# EasyEDA Pro project ProPrj_STM32F103ZET6_2025-04-15.epro, schematic STM32F103ZET6 开发板

## Sheets
1 核心: Board Name: STM32F103ZET6 开发板; Create Date: 2025-03-17; Page Name: 核心; Project Name: STM32F103ZET6; Schematic Name: STM32F103ZET6 开发板; Update Date: 2025-03-17; Add into BOM: yes; Company: NEU; Convert to PCB: yes; Date: 2024-02-03; Draw By: HaoShuai; REV: 1.0; Sheet: 1/3
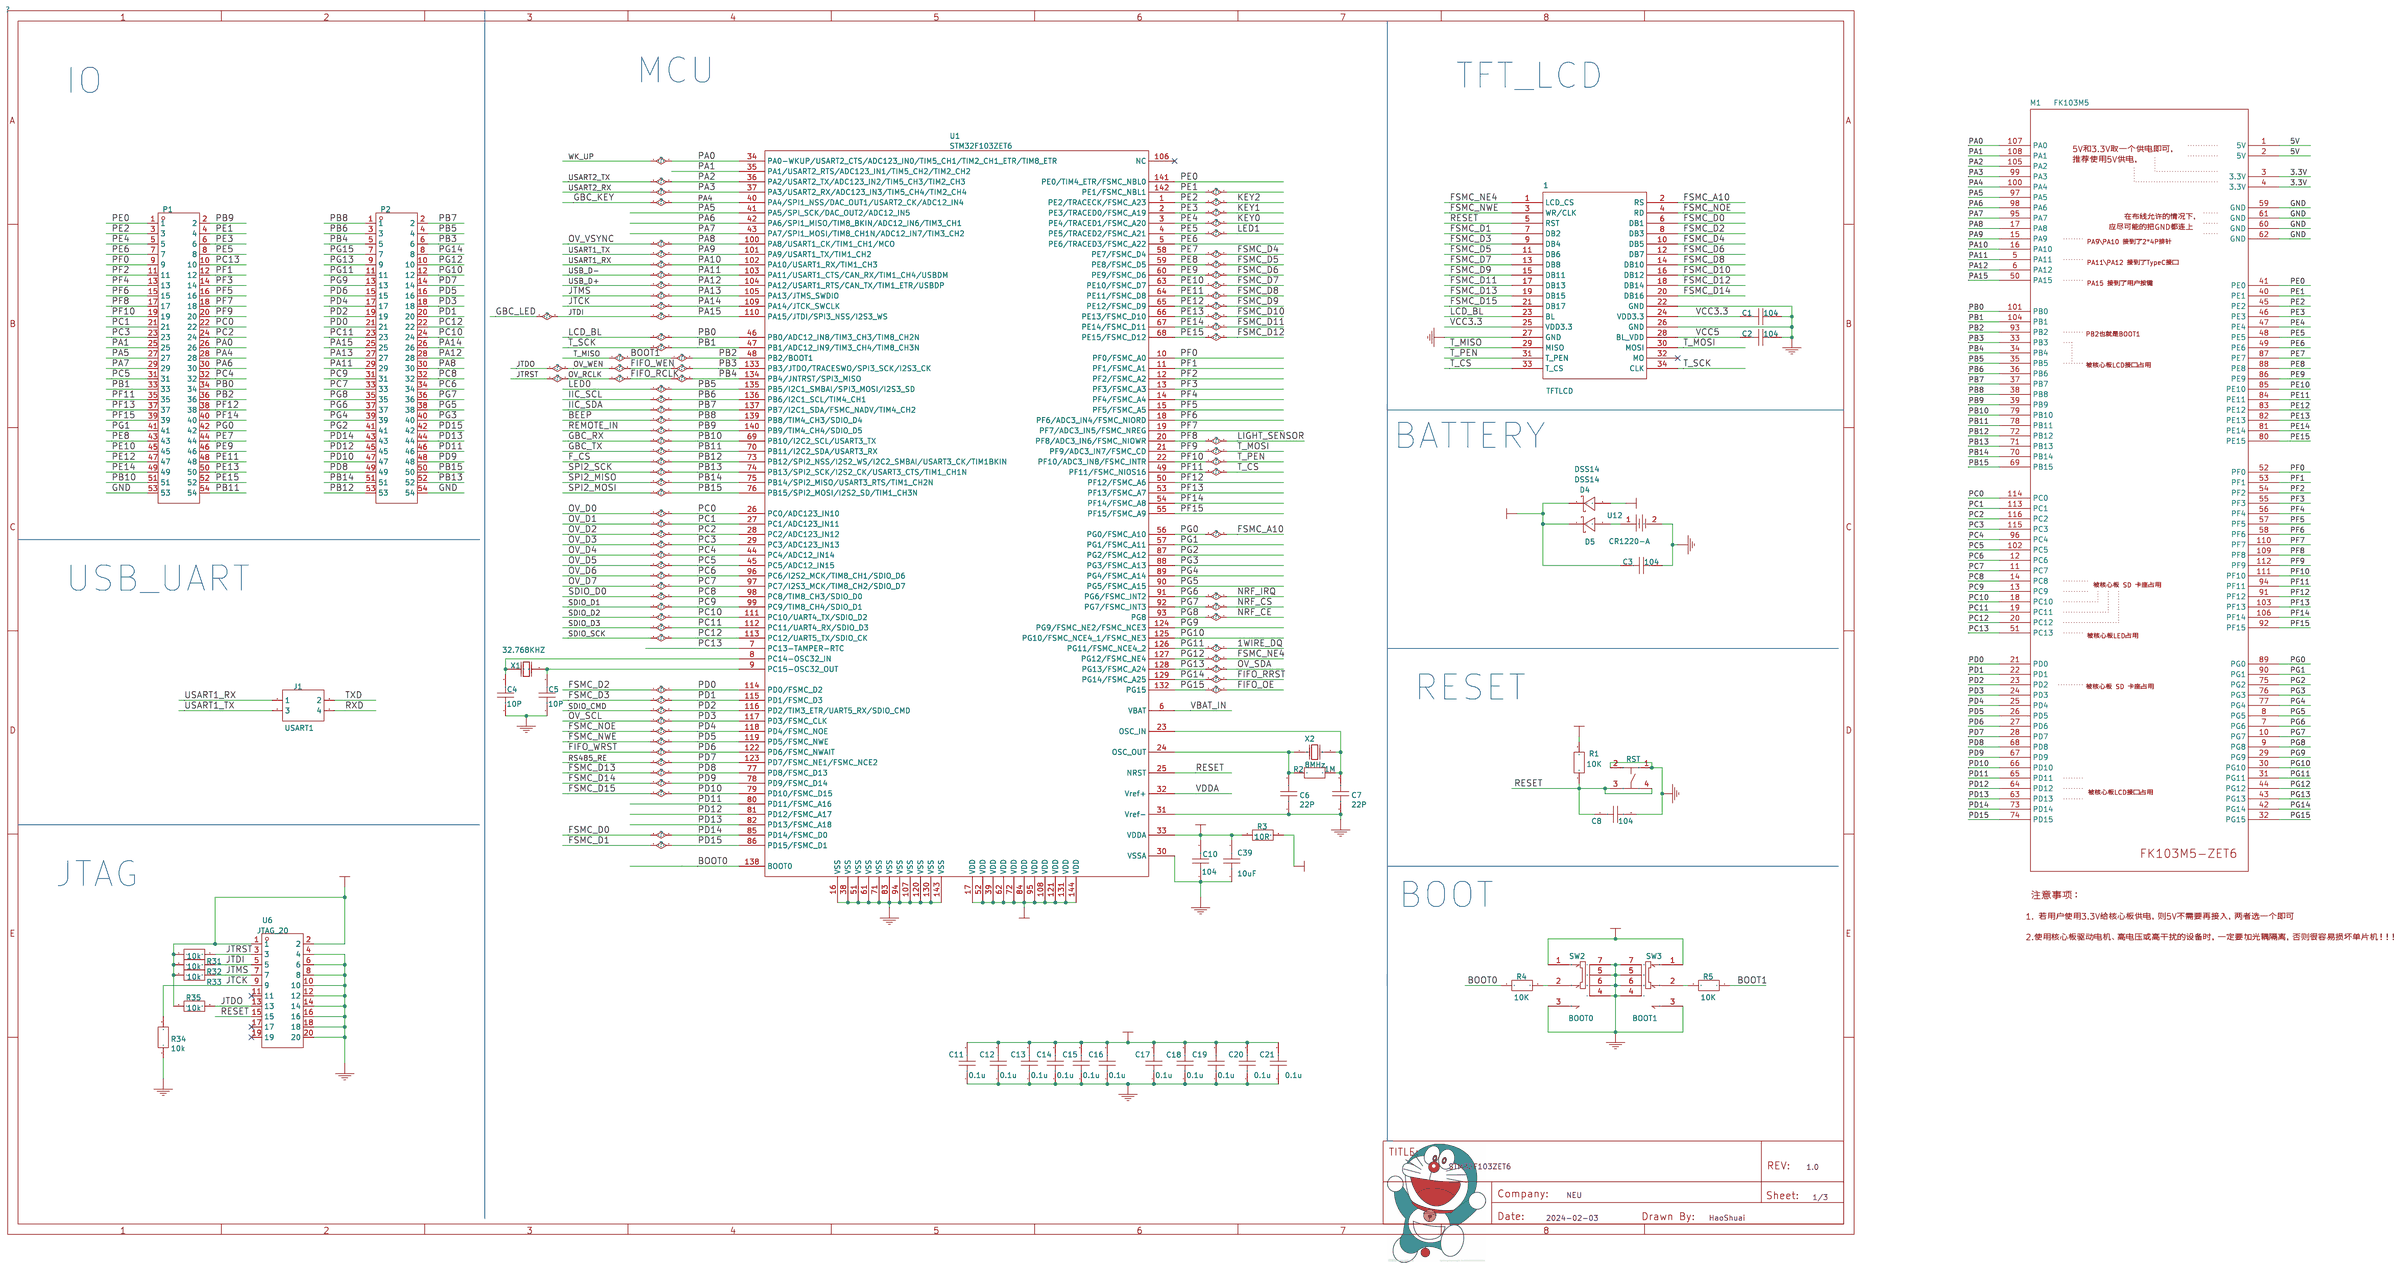
[diagram p1: 核心]
2 电源&USB
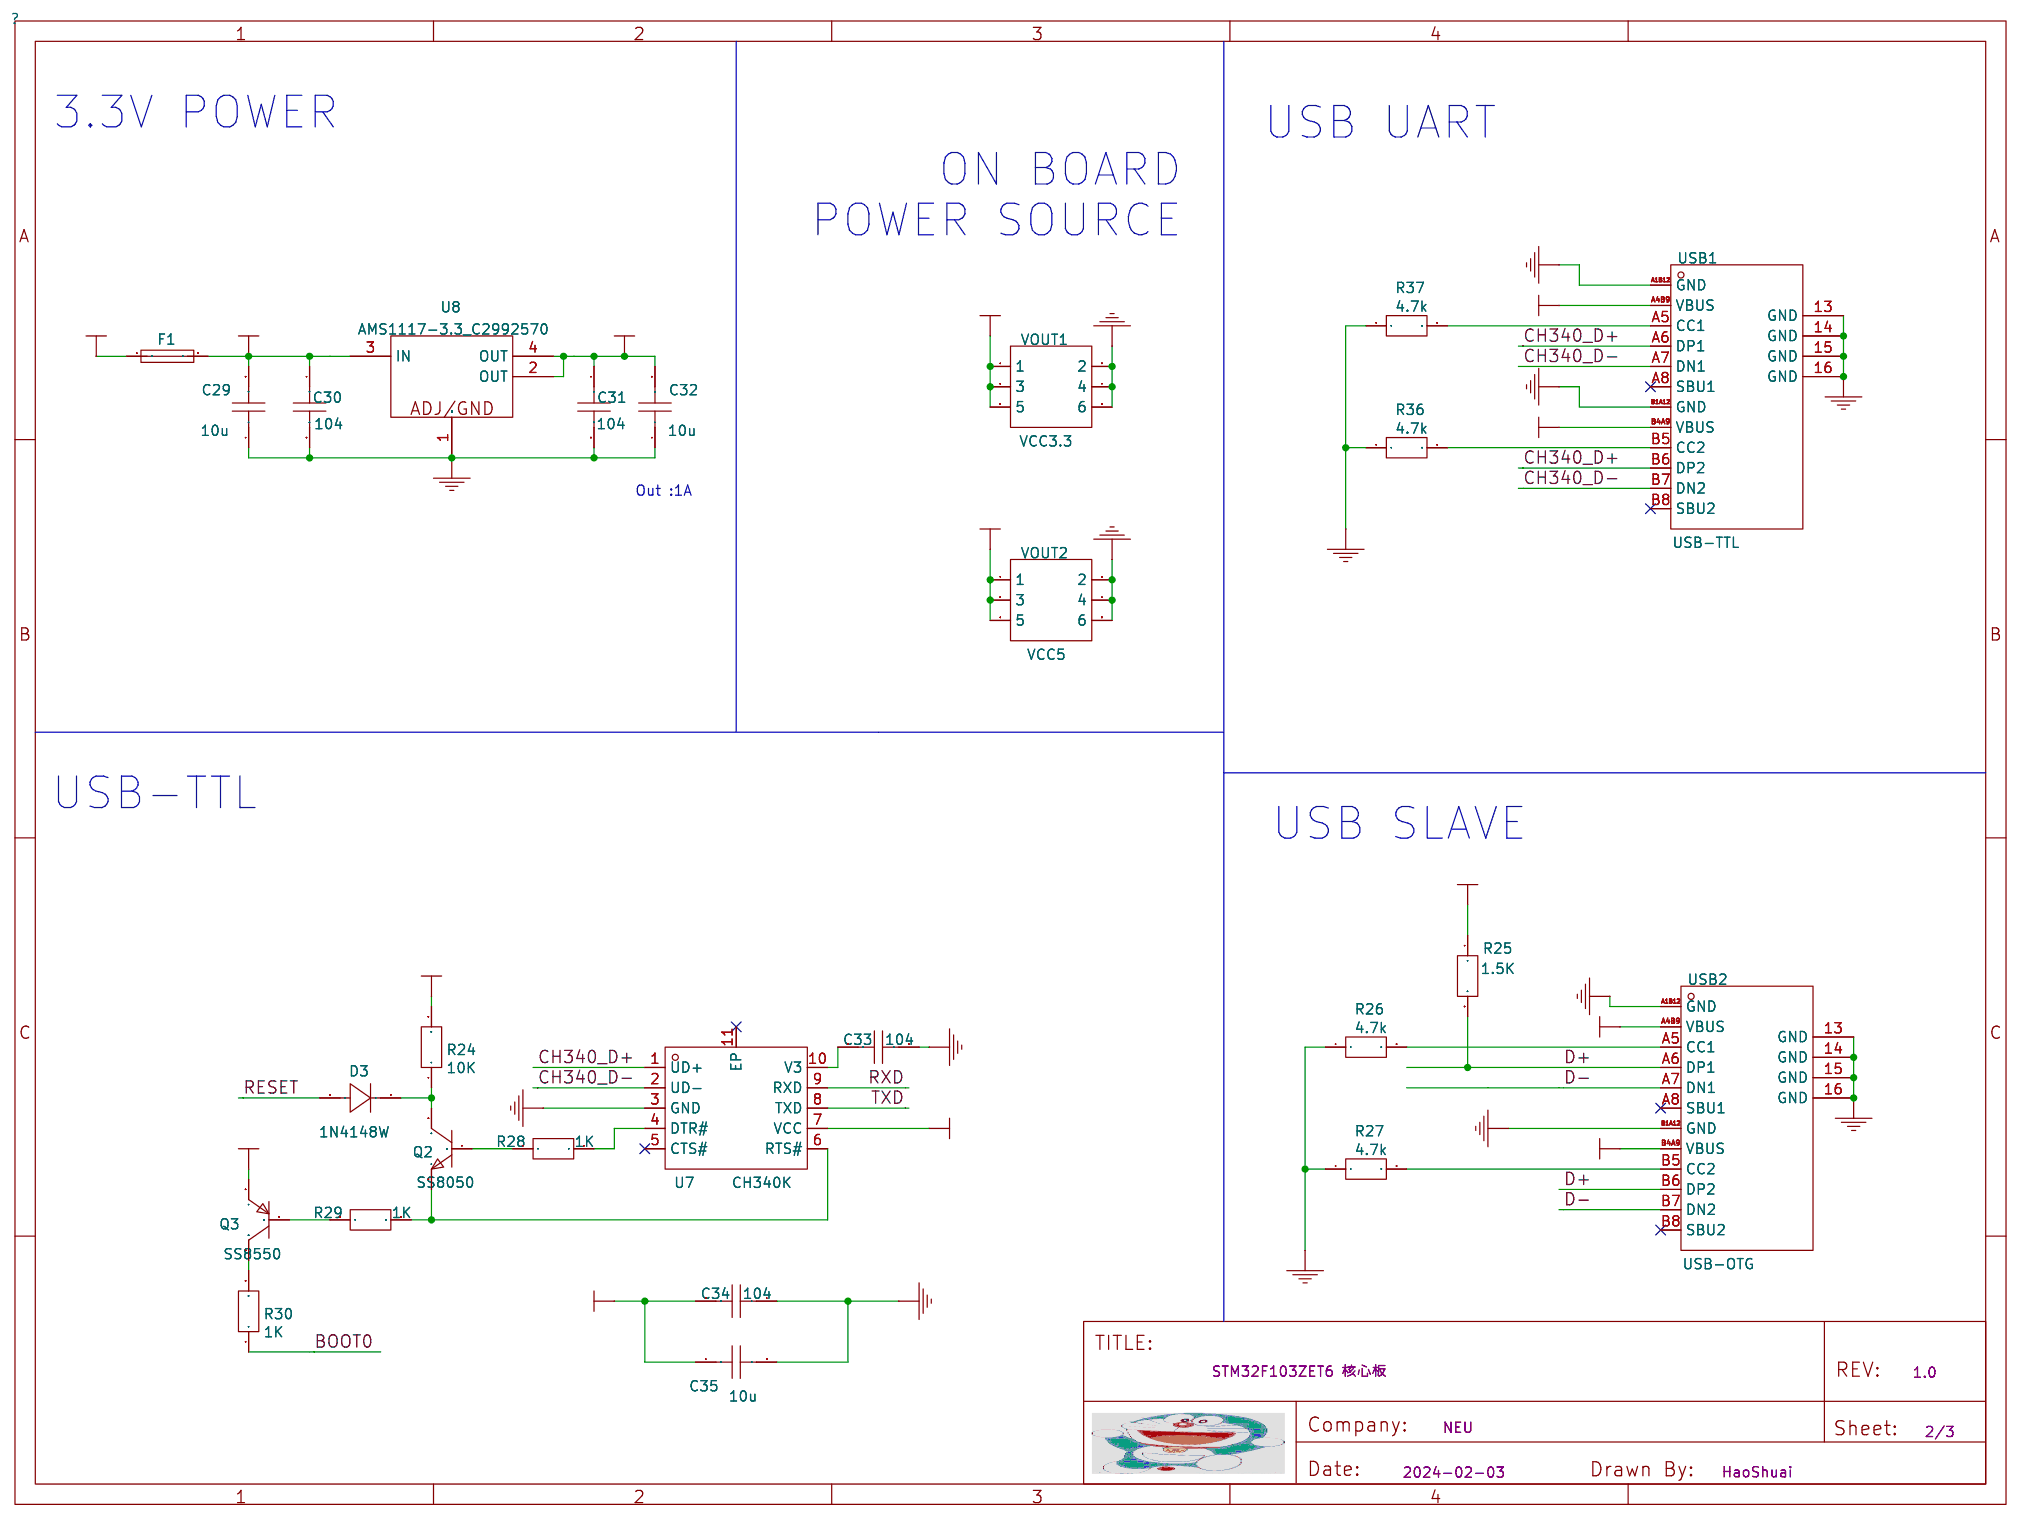
[diagram p2: 电源&USB]
3 外设
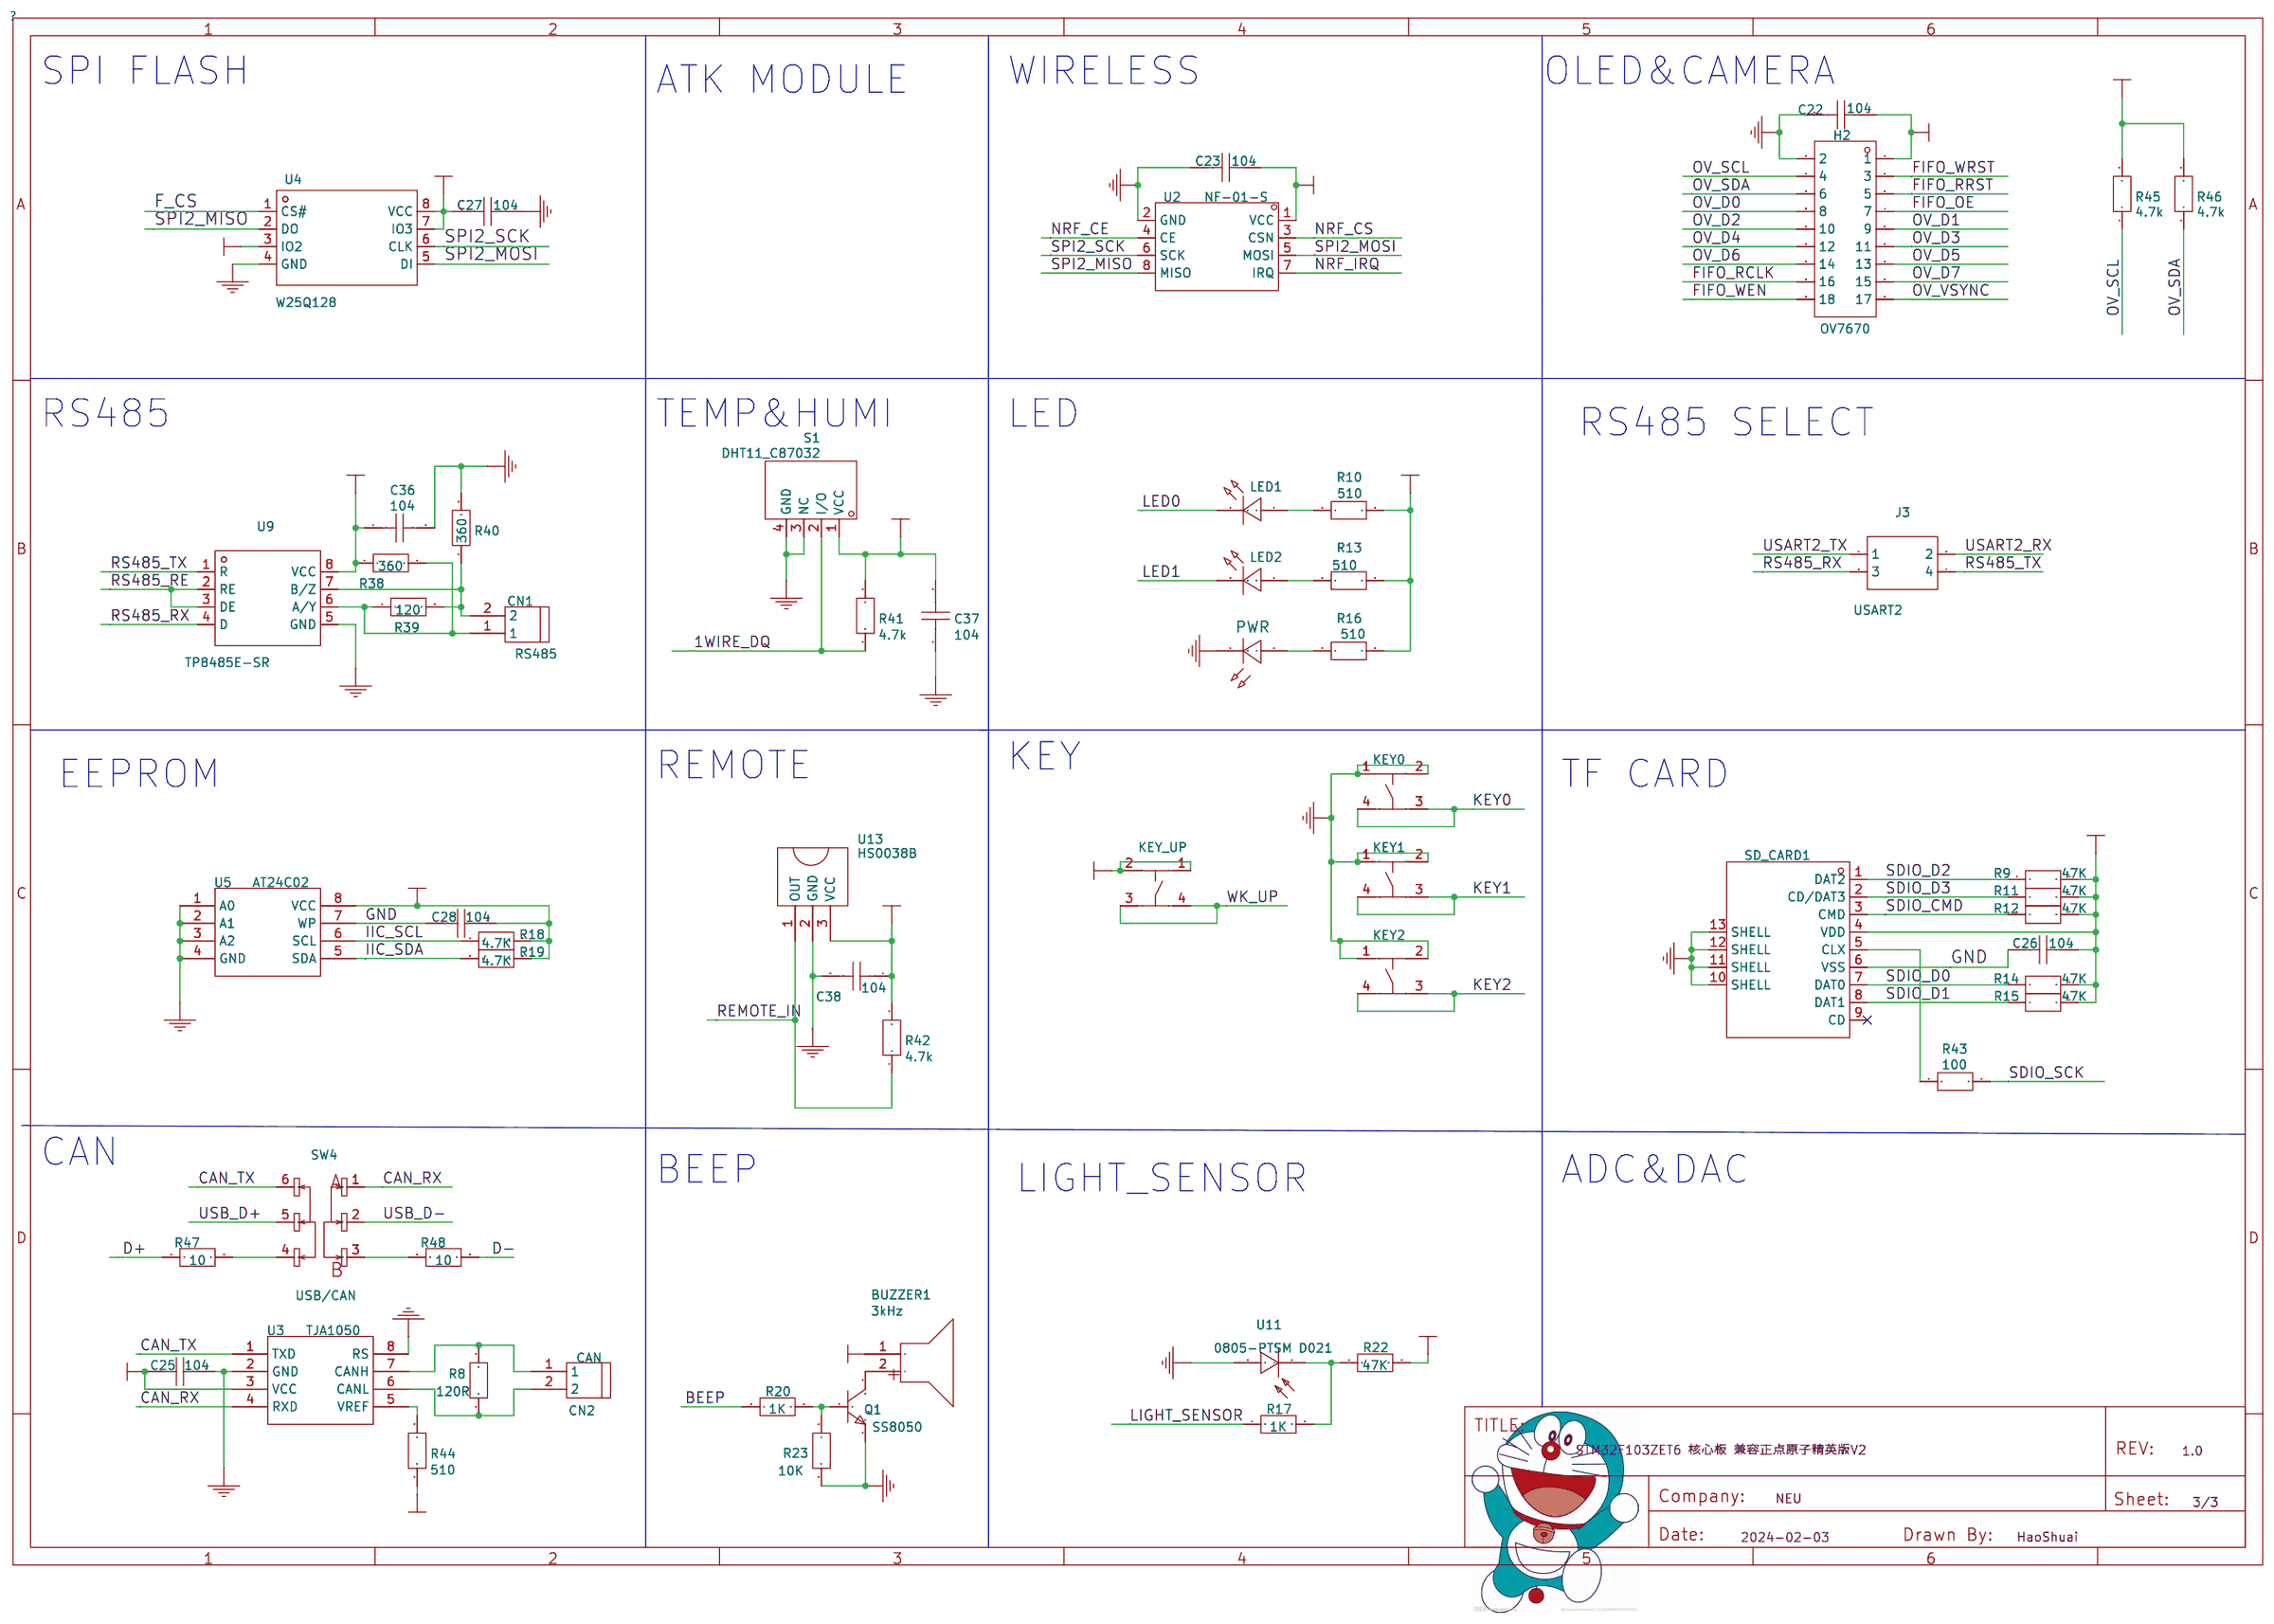
[diagram p3: 外设]

## Parts
sheet 外设
BUZZER1  3kHz  [BUZ-TH_BD9.0-P5.00-D0.6-FD]
C22  104  [C0603]
C23  104  [C0603]
C25  104  [C0603]
C26  104  [C0603]
C27  104  [C0603]
C28  104  [C0603]
C36  104  [C0603]
C37  104  [C0603]
C38  104  [C0603]
CN1  RS485  [CONN-TH_2P-P2.50_XH-2AW]
CN2  CAN  [CONN-TH_2P-P2.50_XH-2AW]
H2  OV7670  [HDR-TH_18P-P2.54-V-F-R2-C9-S2.54-1]
J3  USART2  [HDR-M-2.54_2X2]
LED1  LED-0603_G  [LED0603_GREEN]
LED2  LED-0603_B  [LED0603_BLUE]
PWR  -  [LED_0603]
Q1  SS8050  [SOT-23-3_L2.9-W1.3-P1.90-LS2.4-BR]
R8  120R  [R0603]
R9  47K  [R0603]
R10  510  [R0603]
R11  47K  [R0603]
R12  47K  [R0603]
R13  510  [R0603]
R14  47K  [R0603]
R15  47K  [R0603]
R16  510  [R0603]
R17  1K  [R0603]
R18  4.7K  [R0603]
R19  4.7K  [R0603]
R20  1K  [R0603]
R22  47K  [R0603]
R23  10K  [R0603]
R38  360  [R0603]
R39  120  [R0603]
R40  360  [R0603]
R41  4.7k  [R0603]
R42  4.7k  [R0603]
R43  100  [R0603]
R44  510  [R0603]
R45  4.7k  [R0603]
R46  4.7k  [R0603]
R47  10  [R0603]
R48  10  [R0603]
S1  DHT11_C87032  [SENSOR-TH_DHT11-1]
SD_CARD1  THD2528-11SD-GF  [TF-SMD_THD2528-11SD-GF]
SW4  USB/CAN  [SW-TH_6P-L9.1-W3.5-P2.50]
SW5  KEY_UP  [SW-SMD_4P-L4.2-W3.2-P2.15-LS4.6]
SW6  KEY0  [SW-SMD_4P-L4.2-W3.2-P2.15-LS4.6]
SW7  KEY1  [SW-SMD_4P-L4.2-W3.2-P2.15-LS4.6]
SW8  KEY2  [SW-SMD_4P-L4.2-W3.2-P2.15-LS4.6]
U2  NF-01-S  [NF-01-S]
U3  TJA1050  [SOIC-8_L5.0-W4.0-P1.27-LS6.0-BL]
U4  W25Q128  [SOIC-8_L5.3-W5.3-P1.27-LS8.0-BL]
U5  AT24C02  [SOIC-8_L5.0-W4.0-P1.27-LS6.0-BL]
U9  TP8485E-SR  [SOIC-8_L5.0-W4.0-P1.27-LS6.0-BL]
U11  0805-PTSM D021  [OPTO-SMD_L2.0-W1.3-RD]
U13  HS0038B  [OPTO-TH_HS0038B-A]
sheet 核心
1  TFTLCD  [TFTLCD_2_4/2_8/3_5]
C1  104  [C0603]
C2  104  [C0603]
C3  104  [C0603]
C4  10P  [C0603]
C5  10P  [C0603]
C6  22P  [C0603]
C7  22P  [C0603]
C8  104  [C0603]
C10  104  [C0603]
C11  0.1u  [C0603]
C12  0.1u  [C0603]
C13  0.1u  [C0603]
C14  0.1u  [C0603]
C15  0.1u  [C0603]
C16  0.1u  [C0603]
C17  0.1u  [C0603]
C18  0.1u  [C0603]
C19  0.1u  [C0603]
C20  0.1u  [C0603]
C21  0.1u  [C0603]
C39  10uF  [C0805]
D4  DSS14  [SOD-123_L2.8-W1.8-LS3.7-RD]
D5  DSS14  [SOD-123_L2.8-W1.8-LS3.7-RD]
J1  USART1  [HDR-M-2.54_2X2]
M1  FK103M5  [zet60.11]
P1  X6521WV-2×27H-C30D60  [HDR-TH_54P-2.54-V-M-R2-C27-S2.54]
P2  X6521WV-2×27H-C30D60  [HDR-TH_54P-2.54-V-M-R2-C27-S2.54]
R1  10K  [R0603]
R2  1M  [R0603]
R3  10R  [R0603]
R4  10K  [R0603]
R5  10K  [R0603]
R31  10k  [R0603]
R32  10k  [R0603]
R33  10k  [R0603]
R34  10k  [R0603]
R35  10k  [R0603]
SW1  RST  [SW-SMD_4P-L4.2-W3.2-P2.15-LS4.6]
SW2  BOOT0  [CONN-TH_TA-3524A-A2]
SW3  BOOT1  [CONN-TH_TA-3524A-A2]
U1  STM32F103ZET6  [LQFP144]
U6  JTAG_20  [IDC-TH_20P-P2.54_SAMTEC-HTST-110-01-X-D]
U12  CR1220-A  [BAT-SMD_CR1220-2]
X1  32.768KHZ  [OSC-TH_BD2.0-P0.70-D0.3]
X2  8MHz  [CRYSTAL-SMD_L5.0-W3.2]
sheet 电源&USB
C29  10u  [C0805]
C30  104  [C0603]
C31  104  [C0603]
C32  10u  [C0805]
C33  104  [C0603]
C34  104  [C0603]
C35  10u  [C0805]
D3  1N4148W  [SOD-123_L2.8-W1.8-LS3.7-RD]
F1  6V1A  [F0603]
Q2  SS8050  [SOT-23-3_L2.9-W1.3-P1.90-LS2.4-BR]
Q3  SS8550  [SOT-23-3_L2.9-W1.3-P1.90-LS2.4-BR]
R24  10K  [R0603]
R25  1.5K  [R0603]
R26  4.7k  [R0603]
R27  4.7k  [R0603]
R28  1K  [R0603]
R29  1K  [R0603]
R30  1K  [R0603]
R36  4.7k  [R0603]
R37  4.7k  [R0603]
U7  CH340K  [CH340K中央焊盘修改]
U8  AMS1117-3.3_C2992570  [SOT-223-3_L6.4-W3.5-P2.30-LS7.0-BR]
USB1  USB-TTL  [USB-C-SMD_TYPEC-304S-ACP16]
USB2  USB-OTG  [USB-C-SMD_TYPEC-304S-ACP16]
VOUT1  VCC3.3  [HDR-M-2.54_2X3]
VOUT2  VCC5  [HDR-M-2.54_2X3]

## Library data of the parts
BUZZER1 = 3kHz: Supplier: LCSC; Supplier Part: C96102; Manufacturer: 华能; Manufacturer Part: HNB09A03; JLCPCB Part Class: Extended Part
C1-C3 C8 C10 C22 C23 C25-C28 C30 C31 C33 C34 C36-C38 = 104
CN1 = RS485: Supplier: LCSC; Manufacturer: BOOMELE; Manufacturer Part: XH-2AW; Supplier Part: C33132; JLCPCB Part Class: Extended Part
CN2 = CAN: Supplier: LCSC; Manufacturer: BOOMELE; Manufacturer Part: XH-2AW; Supplier Part: C33132; JLCPCB Part Class: Extended Part
H2 = OV7670: Supplier: LCSC; Manufacturer: BOOMELE; Manufacturer Part: Header-Female-2.54_2x9; Supplier Part: C71956; JLCPCB Part Class: Extended Part
J3 = USART2: Supplier Part: C66690; Supplier: LCSC
LED1 = LED-0603_G: Manufacturer: EVERLIGHT(台湾亿光); Manufacturer Part: 19-217/GHC-YR1S2/3T; Supplier Part: C72043; Supplier: LCSC
LED2 = LED-0603_B: Manufacturer: EVERLIGHT(台湾亿光); Manufacturer Part: 19-217/BHC-ZL1M2RY/3T; Supplier Part: C72041; Supplier: LCSC
PWR = LED_0603-R: Supplier Footprint: 0603
Q1 Q2 = SS8050: Supplier: LCSC; Supplier Part: C2688219; Manufacturer: WPMtek(维攀微); JLCPCB Part Class: Extended Part
R8 = 120R
R9 R11 R12 R14 R15 R22 = 47K
R10 R13 R16 R44 = 510
R17 R20 R28-R30 = 1K
R18 R19 = 4.7K
R1 R4 R5 R23 R24 = 10K
R38 R40 = 360
R39 = 120
R26 R27 R36 R37 R41 R42 R45 R46 = 4.7k
R43 = 100
R47 R48 = 10
S1 = DHT11_C87032: Supplier Part: C87032; Supplier: LCSC; Manufacturer: null; Manufacturer Part: DHT11; JLCPCB Part Class: Extended Part
SD_CARD1 = THD2528-11SD-GF: Supplier: LCSC; Supplier Part: C283232; Manufacturer: THD; JLCPCB Part Class: Extended Part
SW4 = USB/CAN: Supplier: LCSC; Supplier Part: C514021; Manufacturer: Yuandi; Manufacturer Part: TA-3530-A1; JLCPCB Part Class: Extended Part
SW5 = KEY_UP: Supplier: LCSC; Supplier Part: C778166; Manufacturer: G-Switch; Manufacturer Part: GT-TC048A-H025-L1; JLCPCB Part Class: Extended Part
SW6 = KEY0: Supplier: LCSC; Supplier Part: C778166; Manufacturer: G-Switch; Manufacturer Part: GT-TC048A-H025-L1; JLCPCB Part Class: Extended Part
SW7 = KEY1: Supplier: LCSC; Supplier Part: C778166; Manufacturer: G-Switch; Manufacturer Part: GT-TC048A-H025-L1; JLCPCB Part Class: Extended Part
SW8 = KEY2: Supplier: LCSC; Supplier Part: C778166; Manufacturer: G-Switch; Manufacturer Part: GT-TC048A-H025-L1; JLCPCB Part Class: Extended Part
U2 = NF-01-S: Supplier: LCSC; Supplier Part: C135576; Manufacturer: Ai-Thinker; JLCPCB Part Class: Extended Part
U3 = TJA1050: Supplier: LCSC; Manufacturer: NXP; Manufacturer Part: TJA1050T/CM,118; Supplier Part: C6952; JLCPCB Part Class: Basic Part
U4 = W25Q128: Supplier: LCSC; Manufacturer: WINBOND; Manufacturer Part: W25Q128JVSIQTR; Supplier Part: C2763561; JLCPCB Part Class: Basic Part
U5 = AT24C02: Supplier: LCSC; Manufacturer: MICROCHIP; Manufacturer Part: AT24C02D-SSHM-T; Supplier Part: C34807; JLCPCB Part Class: Extended Part
U9 = TP8485E-SR: Supplier: LCSC; Manufacturer: 3PEAK; Supplier Part: C94206; JLCPCB Part Class: Extended Part
U11 = 0805-PTSM D021: Supplier: LCSC; Supplier Part: C242254; Manufacturer: JCHL(晶创和立); Manufacturer Part: 0805-PTSMD021; JLCPCB Part Class: Extended Part
U13 = HS0038B: Supplier Part: C9900001501; Supplier Footprint: DIP-3; JLCPCB Part Class: 扩展库; Supplier: LCSC
1 = TFTLCD: Supplier Part: C92264; Supplier: LCSC
C4 C5 = 10P
C6 C7 = 22P
C11-C21 = 0.1u
C39 = CAP_0805: Supplier Footprint: 0805
D4 D5 = DSS14_C59293: 正向压降(Vf):550mV@1A;直流反向耐压(Vr):40V;平均整流电流(Io):1A;; LCSC Part Name: 电压:40V 电流:1A; Supplier Part: C59293; Manufacturer: 星海; Supplier Footprint: SOD-123FL; JLCPCB Part Class: 扩展库; Datasheet: https://atta.szlcsc.com/upload/public/pdf/source/20151026/1457707506941.pdf; Supplier: LCSC; Forward Voltage (Vf@If): 550mV@1A; Reverse Voltage (Vr): 40V; Average Rectified Current (Io): 1A
J1 = USART1: Supplier Part: C66690; Supplier: LCSC
M1 = FK103M5
P1 P2 = X6521WV-2×27H-C30D60: Supplier: LCSC; Supplier Part: C725899; Manufacturer: XKB Connectivity; JLCPCB Part Class: Extended Part
R2 = 1M
R3 = 10R
R31-R35 = 10k
SW1 = RST: Supplier: LCSC; Supplier Part: C778166; Manufacturer: G-Switch; Manufacturer Part: GT-TC048A-H025-L1; JLCPCB Part Class: Extended Part
SW2 = BOOT0: Supplier: LCSC; Supplier Part: C730329; Manufacturer: Yuandi; Manufacturer Part: TA-3524A-A1-W; JLCPCB Part Class: Extended Part
SW3 = BOOT1: Supplier: LCSC; Supplier Part: C730329; Manufacturer: Yuandi; Manufacturer Part: TA-3524A-A1-W; JLCPCB Part Class: Extended Part
U1 = STM32F103ZET6
U6 = JTAG_20_C9900040131: Supplier: LCSC; Supplier Part: C9900040131; Manufacturer: null; JLCPCB Part Class: Extended Part
U12 = CR1220-A: Supplier: LCSC; Supplier Part: C9900016718; Manufacturer: null; JLCPCB Part Class: Extended Part
X1 = 32.768KHZ: Supplier: LCSC; Supplier Part: C389950; Manufacturer: CITIZEN; Manufacturer Part: CFS20632768DZF
X2 = X50328MSB2GI: 晶振类型:贴片晶振;频率:8MHz;常温频差:±10ppm;外接负载电容:20pF;频率稳定度(全温):±50ppm;; LCSC Part Name: 8MHz ±10ppm 20pF YSX530GA; Supplier Part: C115962; Manufacturer: YXC(扬兴晶振); Supplier Footprint: SMD5032; JLCPCB Part Class: 基础库; Datasheet: https://atta.szlcsc.com/upload/public/pdf/source/20230220/0EBFFB9D6D8CE6A211407822BBB6C516.pdf; Supplier: LCSC; Crystal Type: 贴片晶振; Normal temperature Frequency Tolerance: ±10ppm; External load capacitor: 20pF; Frequency Stability(Full temperature range): ±50ppm; Operating Temperature: -40℃~+85℃
C29 C32 = 100u
C35 = 10u
D3 = 1N4148W: Supplier: LCSC; Supplier Part: C1884539; Manufacturer: YFW佑风微; JLCPCB Part Class: Extended Part
F1 = 6V1A: Supplier: LCSC; Supplier Part: C2757929; Manufacturer: BHFUSE(佰宏); Manufacturer Part: BSMD0603L-100; JLCPCB Part Class: Extended Part
Q3 = SS8550: Supplier: LCSC; Supplier Part: C2762207; Manufacturer: 晶导微电子; JLCPCB Part Class: Extended Part
R25 = 1.5K
U7 = CH340K: Supplier: LCSC; Supplier Part: C968586; Manufacturer: WCH(Jiangsu Qin Heng); JLCPCB Part Class: Extended Part
U8 = AMS1117-3.3_C2992570: Supplier: LCSC; Supplier Part: C2992570; Manufacturer: 国芯佳品; Manufacturer Part: AMS1117-3.3; JLCPCB Part Class: Extended Part
USB1 = USB-TTL: Supplier: LCSC; Supplier Part: C720630; Manufacturer: XUNPU; Manufacturer Part: TYPEC-304S-ACP16; JLCPCB Part Class: Extended Part
USB2 = USB-OTG: Supplier: LCSC; Supplier Part: C720630; Manufacturer: XUNPU; Manufacturer Part: TYPEC-304S-ACP16; JLCPCB Part Class: Extended Part
VOUT1 = VCC3.3: Supplier Part: C65114; Supplier: LCSC
VOUT2 = VCC5: Supplier Part: C65114; Supplier: LCSC

## Nets
3.3V: M1.3(3.3V) M1.4(3.3V)
5V: M1.1(5V) M1.2(5V)
GND: 1.22(GND) 1.26(GND) 1.27(GND) C1.2 C2.2 C3.2 C4.1 C5.1 C6.1 C7.1 C8.2 C10.1 C11.1 C12.1 C13.1 C14.1 C15.1 C16.1 C17.1 C18.1 C19.1 C20.1 C21.1 C22.2 C23.2 C25.2 C26.2 C27.1 C28.1 C29.1 C30.2 C31.2 C32.1 C33.1 C34.1 C35.2 C36.2 C37.1 C38.2 C39.2 H2.2 M1.59(GND) M1.60(GND) M1.61(GND) M1.62(GND) P1.53 P2.54 PWR.1(C) Q1.2(E) R23.2 R26.1 R27.1 R34.1 R36.1 R37.1 R40.2 S1.3(NC) S1.4(GND) SD_CARD1.6(VSS) SD_CARD1.10(SHELL) SD_CARD1.11(SHELL) SD_CARD1.12(SHELL) SD_CARD1.13(SHELL) SW1.1 SW1.2 SW2.3 SW2.4 SW2.5 SW2.6 SW2.7 SW3.3 SW3.4 SW3.5 SW3.6 SW3.7 SW6.1 SW6.2 SW7.1 SW7.2 SW8.1 SW8.2 U1.16(VSS) U1.30(VSSA) U1.31(Vref-) U1.38(VSS) U1.51(VSS) U1.61(VSS) U1.71(VSS) U1.83(VSS) U1.94(VSS) U1.107(VSS) U1.120(VSS) U1.130(VSS) U1.143(VSS) U2.2(GND) U3.2(GND) U3.8(RS) U4.4(GND) U5.1(A0) U5.2(A1) U5.3(A2) U5.4(GND) U5.7(WP) U6.4 U6.6 U6.8 U6.10 U6.12 U6.14 U6.16 U6.18 U6.20 U7.3(GND) U8.1(ADJ/GND) U9.5(GND) U11.2(A) U12.2 U13.2(GND) USB1.13(GND) USB1.14(GND) USB1.15(GND) USB1.16(GND) USB1.A1B12(GND) USB1.B1A12(GND) USB2.13(GND) USB2.14(GND) USB2.15(GND) USB2.16(GND) USB2.A1B12(GND) USB2.B1A12(GND) VOUT1.2 VOUT1.4 VOUT1.6 VOUT2.2 VOUT2.4 VOUT2.6
VBAT_IN: C3.1 D4.1(K) D5.1(K) U1.6(VBAT)
VCC3.3: 1.24(VDD3.3) 1.25(VDD3.3) BUZZER1.1(+) C1.1 C11.2 C12.2 C13.2 C14.2 C15.2 C16.2 C17.2 C18.2 C19.2 C20.2 C21.2 C22.1 C23.1 C26.1 C27.2 C28.2 C31.1 C32.2 C36.1 C37.2 C38.1 D4.2(A) H2.1 Q3.2(E) R1.2 R3.2 R9.2 R10.2 R11.2 R12.2 R13.1 R14.2 R15.2 R16.1 R18.2 R19.2 R22.2 R24.2 R25.1 R31.1 R32.1 R33.1 R35.1 R38.1 R41.2 R42.2 R44.1 R45.2 R46.2 S1.1(VCC) SD_CARD1.4(VDD) SW2.1 SW3.1 SW5.1 SW5.2 U1.17(VDD) U1.39(VDD) U1.52(VDD) U1.62(VDD) U1.72(VDD) U1.84(VDD) U1.95(VDD) U1.108(VDD) U1.121(VDD) U1.131(VDD) U1.144(VDD) U2.1(VCC) U4.3(IO2) U4.7(IO3) U4.8(VCC) U5.8(VCC) U6.1 U6.2 U8.2(OUT) U8.4(OUT) U9.8(VCC) U13.3(VCC) VOUT1.1 VOUT1.3 VOUT1.5
VCC5: 1.28(BL_VDD) C2.1 C25.1 C29.2 C30.1 C34.2 C35.1 F1.2 U3.3(VCC) U7.7(VCC) U8.3(IN) VOUT2.1 VOUT2.3 VOUT2.5
VDDA: C10.2 C39.1 R3.1 U1.32(Vref+) U1.33(VDDA)
1WIRE_DQ: M1.31(PG11) P2.11 R41.1 S1.2(I/O) U1.126(PG11/FSMC_NCE4_2)
BEEP: M1.38(PB8) P2.1 R20.1 U1.139(PB8/TIM4_CH3/SDIO_D4)
BOOT0: R4.1 R30.1 U1.138(BOOT0)
BOOT1: 1.29(MISO) M1.93(PB2) P1.36 R5.1 U1.48(PB2/BOOT1)
CAN_RX: SW4.1 U3.4(RXD)
CAN_TX: SW4.6 U3.1(TXD)
CH340_D+: U7.1(UD+) USB1.A6(DP1) USB1.B6(DP2)
CH340_D-: U7.2(UD-) USB1.A7(DN1) USB1.B7(DN2)
D+: R25.2 R47.1 USB2.A6(DP1) USB2.B6(DP2)
D-: R48.2 USB2.A7(DN1) USB2.B7(DN2)
F_CS: M1.72(PB12) P2.53 U1.73(PB12/SPI2_NSS/I2S2_WS/I2C2_SMBAI/USART3_CK/TIM1BKIN) U4.1(CS#)
FIFO_OE: H2.7 M1.32(PG15) P2.7 U1.132(PG15)
FIFO_RCLK: H2.16 M1.34(PB4) P2.5 R31.2 U1.134(PB4/JNTRST/SPI3_MISO) U6.3
FIFO_RRST: H2.5 M1.42(PG14) P2.8 U1.129(PG14/FSMC_A25)
FIFO_WEN: H2.18 M1.33(PB3) P2.6 R35.2 U1.133(PB3/JTDO/TRACESWO/SPI3_SCK/I2S3_CK) U6.13
FIFO_WRST: H2.3 M1.27(PD6) P2.15 U1.122(PD6/FSMC_NWAIT)
FSMC_A10: 1.2(RS) M1.89(PG0) P1.42 U1.56(PG0/FSMC_A10)
FSMC_D0: 1.6(DB1) M1.73(PD14) P2.43 U1.85(PD14/FSMC_D0)
FSMC_D1: 1.7(DB2) M1.74(PD15) P2.42 U1.86(PD15/FSMC_D1)
FSMC_D2: 1.8(DB3) M1.21(PD0) P2.21 U1.114(PD0/FSMC_D2)
FSMC_D3: 1.9(DB4) M1.22(PD1) P2.20 U1.115(PD1/FSMC_D3)
FSMC_D4: 1.10(DB5) M1.87(PE7) P1.44 U1.58(PE7/FSMC_D4)
FSMC_D5: 1.11(DB6) M1.88(PE8) P1.43 U1.59(PE8/FSMC_D5)
FSMC_D6: 1.12(DB7) M1.86(PE9) P1.46 U1.60(PE9/FSMC_D6)
FSMC_D7: 1.13(DB8) M1.85(PE10) P1.45 U1.63(PE10/FSMC_D7)
FSMC_D8: 1.14(DB10) M1.84(PE11) P1.48 U1.64(PE11/FSMC_D8)
FSMC_D9: 1.15(DB11) M1.83(PE12) P1.47 U1.65(PE12/FSMC_D9)
FSMC_D10: 1.16(DB12) M1.82(PE13) P1.50 U1.66(PE13/FSMC_D10)
FSMC_D11: 1.17(DB13) M1.81(PE14) P1.49 U1.67(PE14/FSMC_D11)
FSMC_D12: 1.18(DB14) M1.80(PE15) P1.52 U1.68(PE15/FSMC_D12)
FSMC_D13: 1.19(DB15) M1.68(PD8) P2.49 U1.77(PD8/FSMC_D13)
FSMC_D14: 1.20(DB16) M1.67(PD9) P2.48 U1.78(PD9/FSMC_D14)
FSMC_D15: 1.21(DB17) M1.66(PD10) P2.47 U1.79(PD10/FSMC_D15)
FSMC_NE4: 1.1(LCD_CS) M1.44(PG12) P2.10 U1.127(PG12/FSMC_NE4)
FSMC_NOE: 1.4(RD) M1.25(PD4) P2.17 U1.118(PD4/FSMC_NOE)
FSMC_NWE: 1.3(WR/CLK) M1.26(PD5) P2.16 U1.119(PD5/FSMC_NWE)
GBC_KEY: M1.100(PA4) P1.28 U1.40(PA4/SPI1_NSS/DAC_OUT1/USART2_CK/ADC12_IN4)
GBC_LED: M1.50(PA15) P2.25 R32.2 U1.110(PA15/JTDI/SPI3_NSS/I2S3_WS) U6.5
GBC_RX: M1.79(PB10) P1.51 U1.69(PB10/I2C2_SCL/USART3_TX)
GBC_TX: M1.78(PB11) P1.54 U1.70(PB11/I2C2_SDA/USART3_RX)
IIC_SCL: M1.36(PB6) P2.3 R18.1 U1.136(PB6/I2C1_SCL/TIM4_CH1) U5.6(SCL)
IIC_SDA: M1.37(PB7) P2.2 R19.1 U1.137(PB7/I2C1_SDA/FSMC_NADV/TIM4_CH2) U5.5(SDA)
JTCK: P2.26 R34.2 U1.109(PA14/JTCK_SWCLK) U6.9
JTMS: P2.27 R33.2 U1.105(PA13/JTMS_SWDIO) U6.7
KEY0: M1.47(PE4) P1.5 SW6.3 SW6.4 U1.3(PE4/TRACED1/FSMC_A20)
KEY1: M1.46(PE3) P1.6 SW7.3 SW7.4 U1.2(PE3/TRACED0/FSMC_A19)
KEY2: M1.45(PE2) P1.3 SW8.3 SW8.4 U1.1(PE2/TRACECK/FSMC_A23)
LCD_BL: 1.23(BL) M1.101(PB0) P1.34 U1.46(PB0/ADC12_IN8/TIM3_CH3/TIM8_CH2N)
LED0: LED1.2 M1.35(PB5) P2.4 U1.135(PB5/I2C1_SMBAI/SPI3_MOSI/I2S3_SD)
LED1: LED2.2 M1.48(PE5) P1.8 U1.4(PE5/TRACED2/FSMC_A21)
LIGHT_SENSOR: M1.109(PF8) P1.17 R17.1 U1.20(PF8/ADC3_IN6/FSMC_NIOWR)
NRF_CE: M1.9(PG8) P2.35 U1.93(PG8) U2.4(CE)
NRF_CS: M1.10(PG7) P2.36 U1.92(PG7/FSMC_INT3) U2.3(CSN)
NRF_IRQ: M1.7(PG6) P2.37 U1.91(PG6/FSMC_INT2) U2.7(IRQ)
OV_D0: H2.8 M1.114(PC0) P1.22 U1.26(PC0/ADC123_IN10)
OV_D1: H2.9 M1.113(PC1) P1.21 U1.27(PC1/ADC123_IN11)
OV_D2: H2.10 M1.116(PC2) P1.24 U1.28(PC2/ADC123_IN12)
OV_D3: H2.11 M1.115(PC3) P1.23 U1.29(PC3/ADC123_IN13)
OV_D4: H2.12 M1.96(PC4) P1.32 U1.44(PC4/ADC12_IN14)
OV_D5: H2.13 M1.102(PC5) P1.31 U1.45(PC5/ADC12_IN15)
OV_D6: H2.14 M1.12(PC6) P2.34 U1.96(PC6/I2S2_MCK/TIM8_CH1/SDIO_D6)
OV_D7: H2.15 M1.11(PC7) P2.33 U1.97(PC7/I2S3_MCK/TIM8_CH2/SDIO_D7)
OV_SCL: H2.4 M1.24(PD3) P2.18 R45.1 U1.117(PD3/FSMC_CLK)
OV_SDA: H2.6 M1.43(PG13) P2.9 R46.1 U1.128(PG13/FSMC_A24)
OV_VSYNC: H2.17 M1.17(PA8) P2.30 U1.100(PA8/USART1_CK/TIM1_CH1/MCO)
PA0: M1.107(PA0) P1.26 SW5.3 SW5.4 U1.34(PA0-WKUP/USART2_CTS/ADC123_IN0/TIM5_CH1/TIM2_CH1_ETR/TIM8_ETR)
PA1: M1.108(PA1) P1.25 U1.35(PA1/USART2_RTS/ADC123_IN1/TIM5_CH2/TIM2_CH2)
PA2: J3.1 M1.105(PA2) U1.36(PA2/USART2_TX/ADC123_IN2/TIM5_CH3/TIM2_CH3)
PA3: J3.2 M1.99(PA3) U1.37(PA3/USART2_RX/ADC123_IN3/TIM5_CH4/TIM2_CH4)
PA5: M1.97(PA5) P1.27 U1.41(PA5/SPI_SCK/DAC_OUT2/ADC12_IN5)
PA6: M1.98(PA6) P1.30 U1.42(PA6/SPI1_MISO/TIM8_BKIN/ADC12_IN6/TIM3_CH1)
PA7: M1.95(PA7) P1.29 U1.43(PA7/SPI1_MOSI/TIM8_CH1N/ADC12_IN7/TIM3_CH2)
PA9: J1.3 M1.15(PA9) U1.101(PA9/USART1_TX/TIM1_CH2)
PA10: J1.1 M1.16(PA10) U1.102(PA10/USART1_RX/TIM1_CH3)
PA11: M1.5(PA11) P2.29 SW4.2 U1.103(PA11/USART1_CTS/CAN_RX/TIM1_CH4/USBDM)
PA12: M1.6(PA12) P2.28 SW4.5 U1.104(PA12/USART1_RTS/CAN_TX/TIM1_ETR/USBDP)
PB1: 1.34(CLK) M1.104(PB1) P1.33 U1.47(PB1/ADC12_IN9/TIM3_CH4/TIM8_CH3N)
PB9: M1.39(PB9) P1.2 R42.1 U1.140(PB9/TIM4_CH4/SDIO_D5) U13.1(OUT)
PB13: M1.71(PB13) P2.52 U1.74(PB13/SPI2_SCK/I2S2_CK/USART3_CTS/TIM1_CH1N) U2.6(SCK) U4.6(CLK)
PB14: M1.70(PB14) P2.51 U1.75(PB14/SPI2_MISO/USART3_RTS/TIM1_CH2N) U2.8(MISO) U4.2(DO)
PB15: M1.69(PB15) P2.50 U1.76(PB15/SPI2_MOSI/I2S2_SD/TIM1_CH3N) U2.5(MOSI) U4.5(DI)
PC8: M1.14(PC8) P2.32 R14.1 SD_CARD1.7(DAT0) U1.98(PC8/TIM8_CH3/SDIO_D0)
PC9: M1.13(PC9) P2.31 R15.1 SD_CARD1.8(DAT1) U1.99(PC9/TIM8_CH4/SDIO_D1)
PC10: M1.18(PC10) P2.24 R9.1 SD_CARD1.1(DAT2) U1.111(PC10/UART4_TX/SDIO_D2)
PC11: M1.19(PC11) P2.23 R11.1 SD_CARD1.2(CD/DAT3) U1.112(PC11/UART4_RX/SDIO_D3)
PC12: M1.20(PC12) P2.22 R43.1 U1.113(PC12/UART5_TX/SDIO_CK)
PC13: M1.51(PC13) P1.10 U1.7(PC13-TAMPER-RTC)
PD2: M1.23(PD2) P2.19 R12.1 SD_CARD1.3(CMD) U1.116(PD2/TIM3_ETR/UART5_RX/SDIO_CMD)
PD7: M1.28(PD7) P2.14 U1.123(PD7/FSMC_NE1/FSMC_NCE2) U9.2(RE) U9.3(DE)
PD11: M1.65(PD11) P2.46 U1.80(PD11/FSMC_A16)
PD12: M1.64(PD12) P2.45 U1.81(PD12/FSMC_A17)
PD13: M1.63(PD13) P2.44 U1.82(PD13/FSMC_A18)
PE0: M1.41(PE0) P1.1 U1.141(PE0/TIM4_ETR/FSMC_NBL0)
PE1: M1.40(PE1) P1.4 U1.142(PE1/FSMC_NBL1)
PE6: M1.49(PE6) P1.7 U1.5(PE6/TRACED3/FSMC_A22)
PF0: M1.52(PF0) P1.9 U1.10(PF0/FSMC_A0)
PF1: M1.53(PF1) P1.12 U1.11(PF1/FSMC_A1)
PF2: M1.54(PF2) P1.11 U1.12(PF2/FSMC_A2)
PF3: M1.55(PF3) P1.14 U1.13(PF3/FSMC_A3)
PF4: M1.56(PF4) P1.13 U1.14(PF4/FSMC_A4)
PF5: M1.57(PF5) P1.16 U1.15(PF5/FSMC_A5)
PF6: M1.58(PF6) P1.15 U1.18(PF6/ADC3_IN4/FSMC_NIORD)
PF7: M1.110(PF7) P1.18 U1.19(PF7/ADC3_IN5/FSMC_NREG)
PF9: 1.30(MOSI) M1.112(PF9) P1.20 U1.21(PF9/ADC3_IN7/FSMC_CD)
PF10: 1.31(T_PEN) M1.111(PF10) P1.19 U1.22(PF10/ADC3_IN8/FSMC_INTR)
PF11: 1.33(T_CS) M1.94(PF11) P1.35 U1.49(PF11/FSMC_NIOS16)
PF12: M1.91(PF12) P1.38 U1.50(PF12/FSMC_A6)
PF13: M1.103(PF13) P1.37 U1.53(PF13/FSMC_A7)
PF14: M1.106(PF14) P1.40 U1.54(PF14/FSMC_A8)
PF15: M1.92(PF15) P1.39 U1.55(PF15/FSMC_A9)
PG1: M1.90(PG1) P1.41 U1.57(PG1/FSMC_A11)
PG2: M1.75(PG2) P2.41 U1.87(PG2/FSMC_A12)
PG3: M1.76(PG3) P2.40 U1.88(PG3/FSMC_A13)
PG4: M1.77(PG4) P2.39 U1.89(PG4/FSMC_A14)
PG5: M1.8(PG5) P2.38 U1.90(PG5/FSMC_A15)
PG9: M1.29(PG9) P2.13 U1.124(PG9/FSMC_NE2/FSMC_NCE3)
PG10: M1.30(PG10) P2.12 U1.125(PG10/FSMC_NCE4_1/FSMC_NE3)
RESET: 1.5(RST) C8.1 D3.2(A) R1.1 SW1.3 SW1.4 U1.25(NRST) U6.15
RS485_RX: J3.3 U9.4(D)
RS485_TX: J3.4 U9.1(R)
RXD: J1.4 U7.9(RXD)
TXD: J1.2 U7.8(TXD)
USB_5V: F1.1 USB1.A4B9(VBUS) USB1.B4A9(VBUS) USB2.A4B9(VBUS) USB2.B4A9(VBUS)
$1N6: C7.2 R2.2 U1.23(OSC_IN) X2.2(OSC2)
$1N7: C6.2 R2.1 U1.24(OSC_OUT) X2.1(OSC1)
$1N13: C5.2 U1.9(PC15-OSC32_OUT) X1.2(OSC2)
$1N14: C4.2 U1.8(PC14-OSC32_IN) X1.1(OSC1)
$1N20: D5.2(A) U12.1
$1N56: R4.2 SW2.2
$1N57: R5.2 SW3.2
$2N2: Q3.3(C) R30.2
$2N8: C33.2 U7.10(V3)
$2N13: D3.1(K) Q2.3(C) R24.1
$2N15: Q3.1(B) R29.1
$2N16: Q2.1(B) R28.1
$2N17: R28.2 U7.4(DTR#)
$2N18: Q2.2(E) R29.2 U7.6(RTS#)
$2N53: R36.2 USB1.B5(CC2)
$2N54: R37.2 USB1.A5(CC1)
$2N56: R26.2 USB2.A5(CC1)
$2N57: R27.2 USB2.B5(CC2)
$3N10: R43.2 SD_CARD1.5(CLX)
$3N40: R47.2 SW4.4
$3N43: R48.1 SW4.3
$3N44: Q1.1(B) R20.2 R23.1
$3N53: LED1.1 R10.1
$3N54: LED2.1 R13.2
$3N55: PWR.2(A) R16.2
$3N67: R17.2 R22.1 U11.1(K)
$3N74: CN2.1 R8.1 U3.7(CANH)
$3N75: CN2.2 R8.2 U3.6(CANL)
$3N88: CN1.1 R38.2 R39.1 U9.6(A/Y)
$3N90: CN1.2 R39.2 R40.1 U9.7(B/Z)
$3N115: R44.2 U3.5(VREF)
$3N1341: BUZZER1.2(-) Q1.3(C)

Not connected (* = marked no-connect by the designer): 1 32(MO)*; SD_CARD1 9(CD)*; U1 106(NC)*; U6 11* 17* 19*; U7 5(CTS#)* 11(EP)*; USB1 A8(SBU1)* B8(SBU2)*; USB2 A8(SBU1)* B8(SBU2)*

## Notes on the sheets
sheet 1
- MCU
- IO
- TFT_LCD
- BATTERY
- USB_UART
- RESET
- JTAG
- BOOT
sheet 2
- 3.3V POWER
- USB UART
- ON BOARD
  POWER SOURCE
- Out :1A
- USB-TTL
- USB SLAVE
sheet 3
- SPI FLASH
- WIRELESS
- OLED&CAMERA
- ATK MODULE
- RS485
- TEMP&HUMI
- LED
- RS485 SELECT
- KEY
- EEPROM
- REMOTE
- TF CARD
- CAN
- BEEP
- ADC&DAC
- LIGHT_SENSOR
